# Altium project tronic3_prject.PrjPcb
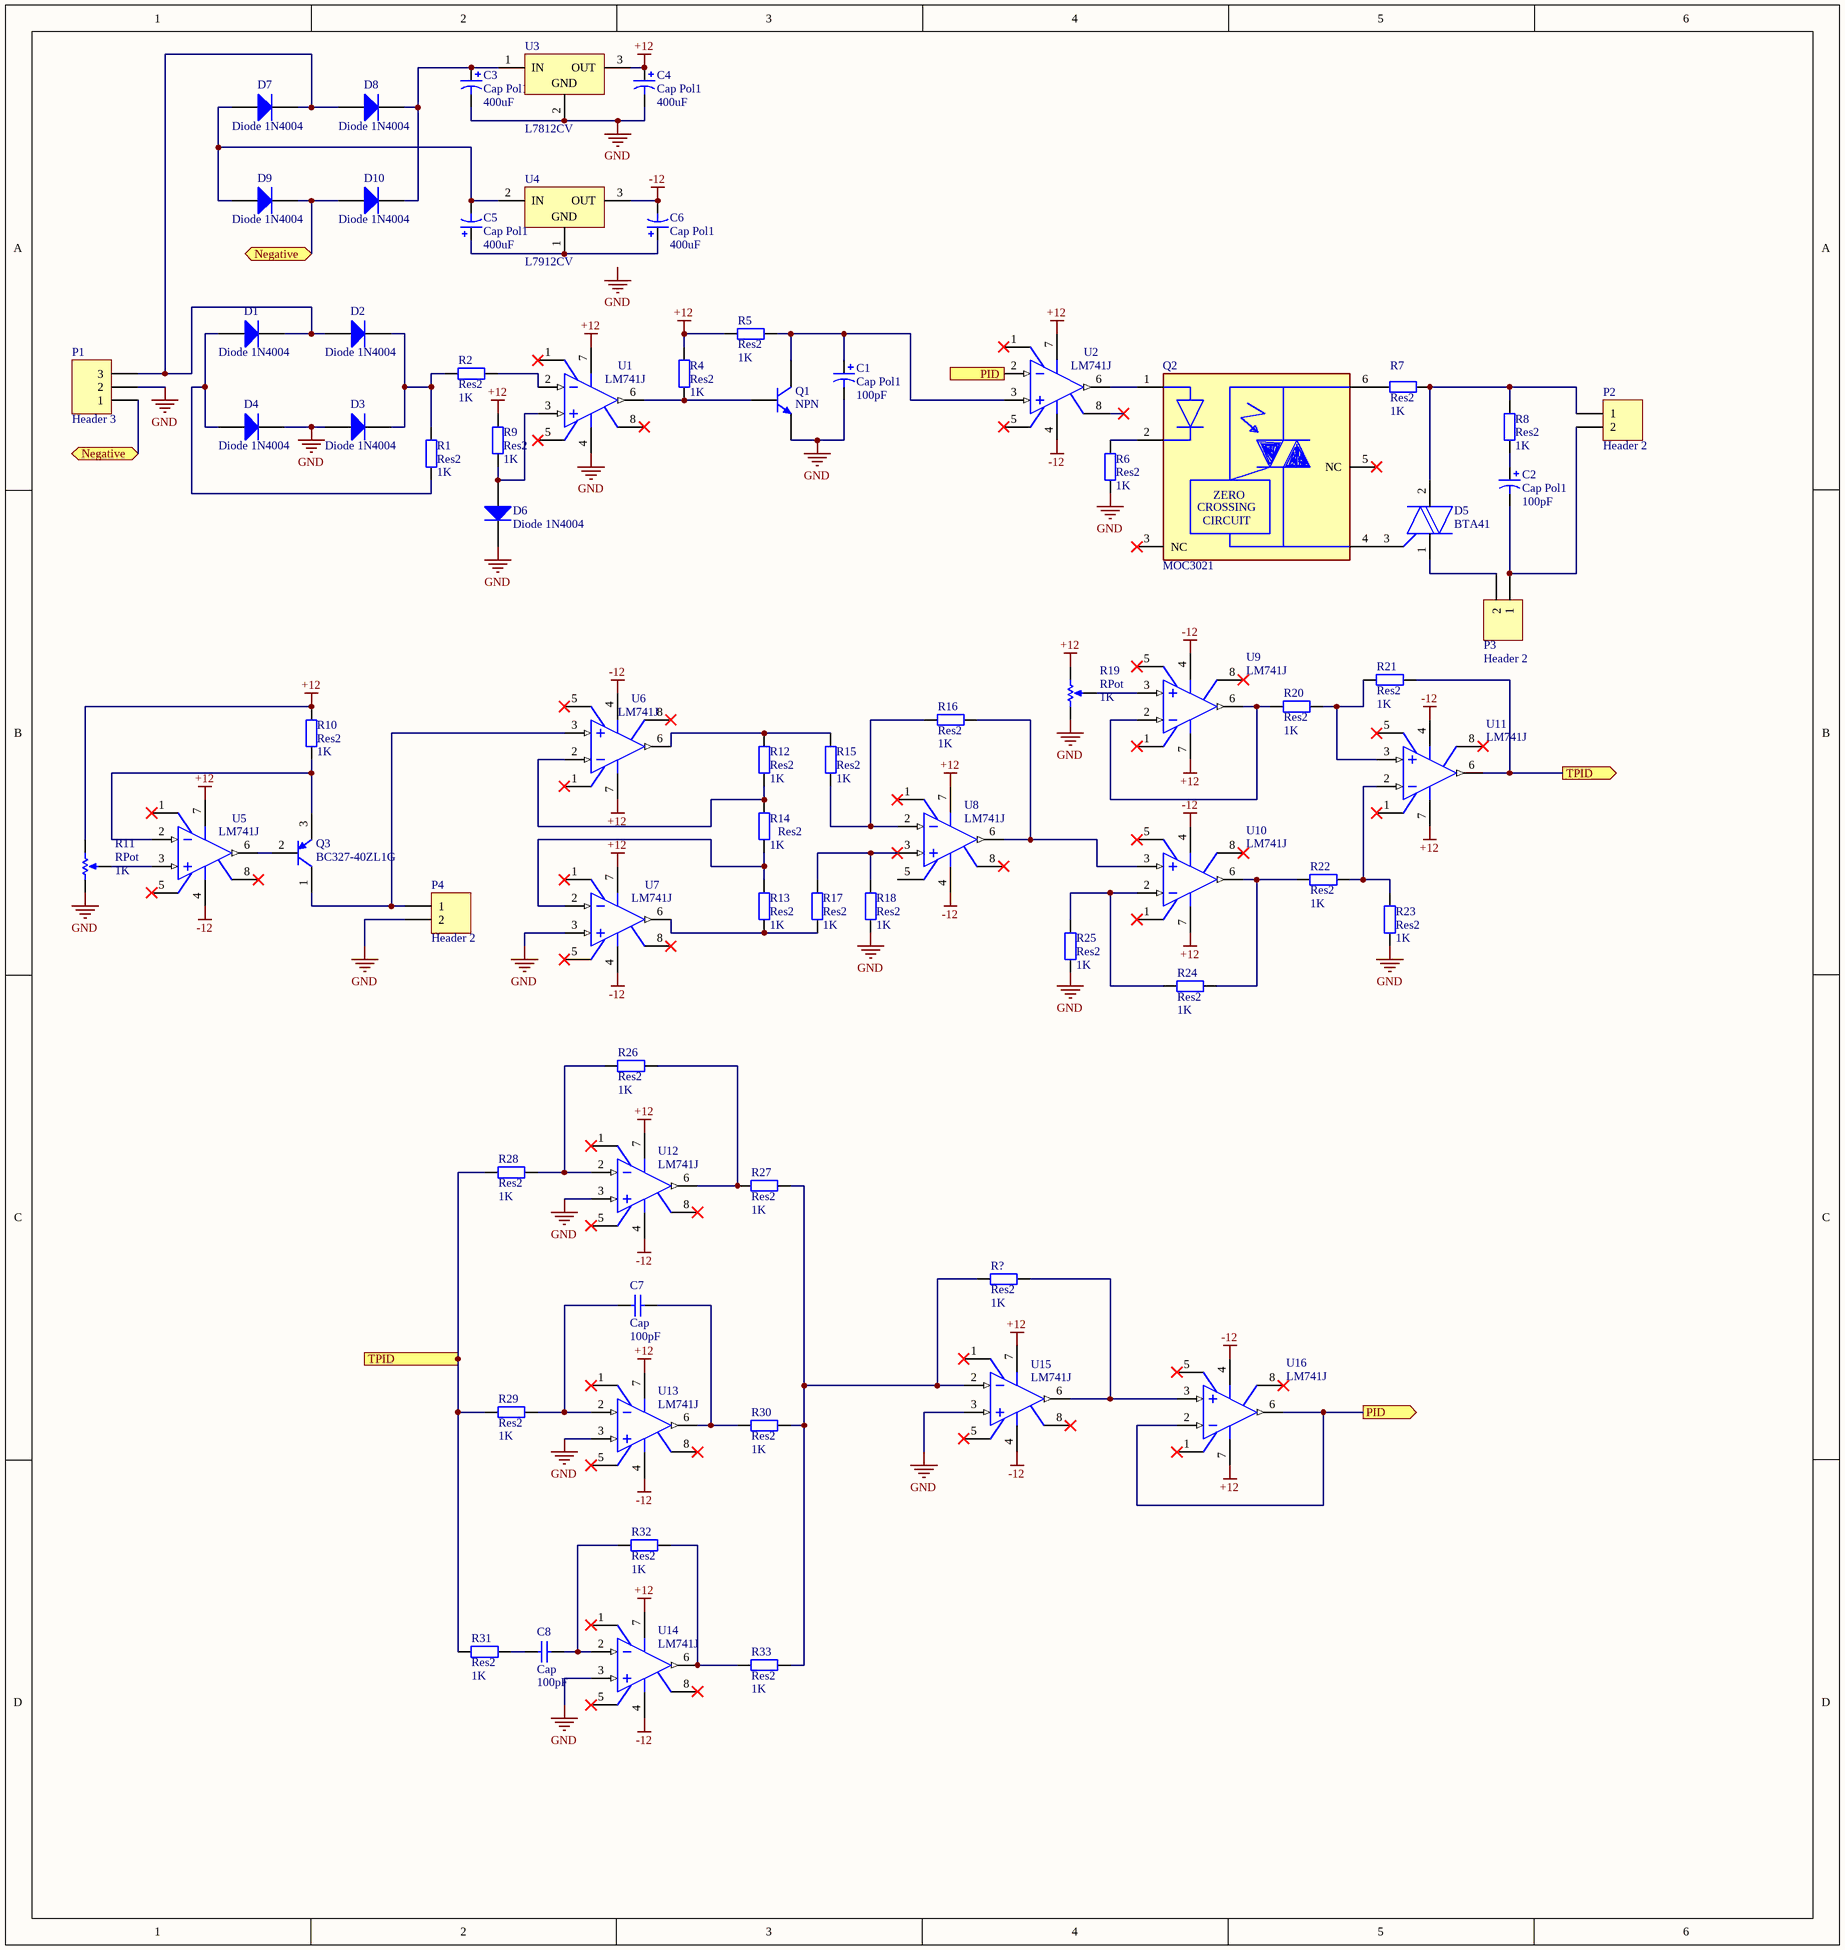
[diagram p0: tronic3_1.SchDoc]
1 sheet, 74 parts. Net scope: flat (ports and power ports of the same name join across sheets).
Board file: PCB1.PcbDoc

## Sheet tronic3_1.SchDoc
size 350 x 369 mm; Date: 9/5/2022; Author: B.D.S. Udayantha; SheetNumber: 1; SheetTotal: 1; SPICEModelCacheOLWESBFQ: <root> / <DocumentId>OLWESBFQ</DocumentId> / <CacheFrame Number="0"> / <Model Name="1n4004" Kind="MDL"> / <Text>*1N4004 MCE 8-16-95 / *400V 1A Si GenPurpose Diode pkg:DIODE0.4 1,2 / .MODEL 1N4004 D(IS=2.55E-9 RS=0.042 N=1.75 TT=5.76E-6 CJO=1.85E-11 / + VJ=0.75 M=0.333 BV=400 IBV=3.95E-5 )</Text> / </Model> / <Model Name="npn" Kind="MDL"> / <Text>*Default NPN BJT / *NPN Trans Pinout: C,B,E / .MODEL NPN NPN()</Text> / </Model> / </CacheFrame> / </root>

### Parts
C1  Cap Pol1  value 100pF  [RB7.6-15]
C2  Cap Pol1  value 100pF  [RB7.6-15]
C3  Cap Pol1  value 400uF  [RB7.6-15]
C4  Cap Pol1  value 400uF  [RB7.6-15]
C5  Cap Pol1  value 400uF  [RB7.6-15]
C6  Cap Pol1  value 400uF  [RB7.6-15]
C7  Cap  value 100pF  [RAD-0.3]
C8  Cap  value 100pF  [RAD-0.3]
D1  Diode 1N4004  [DO-41]
D2  Diode 1N4004  [DO-41]
D3  Diode 1N4004  [DO-41]
D4  Diode 1N4004  [DO-41]
D5  BTA41  [FP-TO-220AB-MFG]
D6  Diode 1N4004  [DO-41]
D7  Diode 1N4004  [DO-41]
D8  Diode 1N4004  [DO-41]
D9  Diode 1N4004  [DO-41]
D10  Diode 1N4004  [DO-41]
P1  Header 3  [HDR1X3]
P2  Header 2  [HDR1X2]
P3  Header 2  [HDR1X2]
P4  Header 2  [HDR1X2]
Q1  NPN  [TO-226-AA]
Q2  MOC3021  [FP-646BX-MFG]
Q3  BC327-40ZL1G  [ONSC-TO-92-3-29-11_AM_BL]
R1  Res2  value 1K  [AXIAL-0.4]
R2  Res2  value 1K  [AXIAL-0.4]
R4  Res2  value 1K  [AXIAL-0.4]
R5  Res2  value 1K  [AXIAL-0.4]
R6  Res2  value 1K  [AXIAL-0.4]
R7  Res2  value 1K  [AXIAL-0.4]
R8  Res2  value 1K  [AXIAL-0.4]
R9  Res2  value 1K  [AXIAL-0.4]
R10  Res2  value 1K  [AXIAL-0.4]
R11  RPot  value 1K  [VR5]
R12  Res2  value 1K  [AXIAL-0.4]
R13  Res2  value 1K  [AXIAL-0.4]
R14  Res2  value 1K  [AXIAL-0.4]
R15  Res2  value 1K  [AXIAL-0.4]
R16  Res2  value 1K  [AXIAL-0.4]
R17  Res2  value 1K  [AXIAL-0.4]
R18  Res2  value 1K  [AXIAL-0.4]
R19  RPot  value 1K  [VR5]
R20  Res2  value 1K  [AXIAL-0.4]
R21  Res2  value 1K  [AXIAL-0.4]
R22  Res2  value 1K  [AXIAL-0.4]
R23  Res2  value 1K  [AXIAL-0.4]
R24  Res2  value 1K  [AXIAL-0.4]
R25  Res2  value 1K  [AXIAL-0.4]
R26  Res2  value 1K  [AXIAL-0.4]
R27  Res2  value 1K  [AXIAL-0.4]
R28  Res2  value 1K  [AXIAL-0.4]
R29  Res2  value 1K  [AXIAL-0.4]
R30  Res2  value 1K  [AXIAL-0.4]
R31  Res2  value 1K  [AXIAL-0.4]
R32  Res2  value 1K  [AXIAL-0.4]
R33  Res2  value 1K  [AXIAL-0.4]
R?  Res2  value 1K  [AXIAL-0.4]
U1  LM741J  [NAB0008A]
U2  LM741J  [NAB0008A]
U3  L7812CV  [TO220]
U4  L7912CV  [TO-220]
U5  LM741J  [NAB0008A]
U6  LM741J  [NAB0008A]
U7  LM741J  [NAB0008A]
U8  LM741J  [NAB0008A]
U9  LM741J  [NAB0008A]
U10  LM741J  [NAB0008A]
U11  LM741J  [NAB0008A]
U12  LM741J  [NAB0008A]
U13  LM741J  [NAB0008A]
U14  LM741J  [NAB0008A]
U15  LM741J  [NAB0008A]
U16  LM741J  [NAB0008A]

### Ports
Negative (bidir), PID (in), PID (out), TPID (in), TPID (out)

### Nets
+12: C4.1 R4.1 R5.1 R9.1 R10.1 R11.2(BOT) R19.2(BOT) U1.7(V+) U2.7(V+) U3.3(OUT) U5.7(V+) U6.7(V+) U7.7(V+) U8.7(V+) U9.7(V+) U10.7(V+) U11.7(V+) U12.7(V+) U13.7(V+) U14.7(V+) U15.7(V+) U16.7(V+)
-12: C6.2 U2.4(V-) U4.3(OUT) U5.4(V-) U6.4(V-) U7.4(V-) U8.4(V-) U9.4(V-) U10.4(V-) U11.4(V-) U12.4(V-) U13.4(V-) U14.4(V-) U15.4(V-) U16.4(V-)
GND: C1.2 C3.2 C4.2 D3.1(A) D4.2(K) D6.2(K) P1.2 P4.2 Q1.3(E) R6.2 R11.1(TOP) R18.2 R19.1(TOP) R23.2 R25.1 U1.4(V-) U3.2(GND) U7.3(IN+) U12.3(IN+) U13.3(IN+) U14.3(IN+) U15.3(IN+)
NetC1_1: C1.1 Q1.1(C) R5.2 U2.3(IN+)
NetC2_1: C2.1 R8.2
NetC2_2: C2.2 P2.2 P3.1
NetC3_1: C3.1 D8.2(K) D10.2(K) U3.1(IN)
NetC5_1: C5.1 C6.1 U4.1(GND)
NetC5_2: C5.2 D7.1(A) D9.1(A) U4.2(IN)
NetC7_1: C7.1 R29.2 U13.2(IN-)
NetC7_2: C7.2 R30.1 U13.6(OUT)
NetC8_1: C8.1 R31.2
NetC8_2: C8.2 R32.1 U14.2(IN-)
NetD1_1: D1.1(A) D4.1(A) R1.2
NetD1_2: D1.2(K) D2.1(A) D7.2(K) D8.1(A) P1.3
NetD2_2: D2.2(K) D3.2(K) R1.1 R2.1
NetD5_1: D5.1(A1) P3.2
NetD5_2: D5.2(A2) P2.1 R7.2 R8.1
NetD5_3: D5.3(G) Q2.4(1_MAIN_TERM.)
NetD6_1: D6.1(A) R9.2 U1.3(IN+)
NetD9_2: D9.2(K) D10.1(A) P1.1 ; port Negative
NetP4_1: P4.1 Q3.1(C) U6.3(IN+)
NetQ1_2: Q1.2(B) R4.2 U1.6(OUT)
NetQ2_1: Q2.1(A) U2.6(OUT)
NetQ2_2: Q2.2(C) R6.1
NetQ2_6: Q2.6(2_MAIN_TERM.) R7.1
NetQ3_2: Q3.2(B) U5.6(OUT)
NetQ3_3: Q3.3(E) R10.2 U5.2(IN-)
NetR2_2: R2.2 U1.2(IN-)
NetR11_3: R11.3(TAP) U5.3(IN+)
NetR12_1: R12.1 R15.1 U6.6(OUT)
NetR12_2: R12.2 R14.1 U6.2(IN-)
NetR13_1: R13.1 R14.2 U7.2(IN-)
NetR13_2: R13.2 R17.2 U7.6(OUT)
NetR15_2: R15.2 R16.1 U8.2(IN-)
NetR16_2: R16.2 U8.6(OUT) U10.3(IN+)
NetR17_1: R17.1 R18.1 U8.3(IN+)
NetR19_3: R19.3(TAP) U9.3(IN+)
NetR20_1: R20.1 U9.2(IN-) U9.6(OUT)
NetR20_2: R20.2 R21.1 U11.3(IN+)
NetR21_2: R21.2 R28.1 R29.1 R31.1 U11.6(OUT) ; port TPID
NetR22_1: R22.1 R24.2 U10.6(OUT)
NetR22_2: R22.2 R23.1 U11.2(IN-)
NetR24_1: R24.1 R25.2 U10.2(IN-)
NetR26_1: R26.1 R28.2 U12.2(IN-)
NetR26_2: R26.2 R27.1 U12.6(OUT)
NetR27_2: R27.2 R30.2 R33.2 R?.1 U15.2(IN-)
NetR32_2: R32.2 R33.1 U14.6(OUT)
NetR?_2: R?.2 U15.6(OUT) U16.3(IN+)
NetU2_2: U2.2(IN-) U16.2(IN-) U16.6(OUT) ; port PID

Not connected (* = marked no-connect by the designer): Q2 3(NC)* 5(NC)*; U1 1(OFS_NULL)* 5(OFS_NULL)* 8(NC)*; U2 1(OFS_NULL)* 5(OFS_NULL)* 8(NC)*; U5 1(OFS_NULL)* 5(OFS_NULL)* 8(NC)*; U6 1(OFS_NULL)* 5(OFS_NULL)* 8(NC)*; U7 1(OFS_NULL)* 5(OFS_NULL)* 8(NC)*; U8 1(OFS_NULL)* 5(OFS_NULL) 8(NC)*; U9 1(OFS_NULL)* 5(OFS_NULL)* 8(NC)*; U10 1(OFS_NULL)* 5(OFS_NULL)* 8(NC)*; U11 1(OFS_NULL)* 5(OFS_NULL)* 8(NC)*; U12 1(OFS_NULL)* 5(OFS_NULL)* 8(NC)*; U13 1(OFS_NULL)* 5(OFS_NULL)* 8(NC)*; U14 1(OFS_NULL)* 5(OFS_NULL)* 8(NC)*; U15 1(OFS_NULL)* 5(OFS_NULL)* 8(NC)*; U16 1(OFS_NULL)* 5(OFS_NULL)* 8(NC)*

### Notes on the sheet
- Labels drawn without touching a wire or pin: GND
- (in symbol CMP-07144-000005-1) ZERO; CROSSING; CIRCUIT

### Library data of the parts
C1-C6 = Cap Pol1: Polarized Capacitor (Radial); Published: 8-Jun-2000; LatestRevisionDate: 17-Jul-2002; LatestRevisionNote: Re-released for DXP Platform.; PackageReference: RB7.6-15; Publisher: Altium Limited; PackageDescription: Polarized Capacitor (Radial); 2 Leads
C7 C8 = Cap: Capacitor; Published: 8-Jun-2000; LatestRevisionDate: 17-Jul-2002; LatestRevisionNote: Re-released for DXP Platform.; PackageReference: RAD-0.3; Publisher: Altium Limited; PackageDescription: Radial Cap, Thru-Hole; 2 Leads; 0.3 in Pin Spacing
D1-D4 D6-D10 = Diode 1N4004: 1 Amp General Purpose Rectifier; Published: 8-Jun-2000; LatestRevisionDate: 17-Jul-2002; LatestRevisionNote: Re-released for DXP Platform.; DatasheetVersion: 1998; PackageVersion: Aug-1999; PackageReference: DO-41; Publisher: Altium Limited; PackageDescription: Diode, Axial; Body 5.2 x 2.7 mm (LxDia. max), Lead Dia. 0.86 mm (max); Code_JEDEC: DO-204-AL; ComponentLink1Description: Manufacturer Link; ComponentLink1URL: http://www.fairchildsemi.com/; ComponentLink2Description: Datasheet; ComponentLink2URL: http://www.fairchildsemi.com/ds/1N%2F1N4001.pdf
D5 = CMP-12193-000008-1: TRIAC ALTERNISTOR 600V TO220AB; Manufacturer: STMicroelectronics; Manufacturer Part Number: BTA24-600BWRG; On State Current Rms: 25A; Max Junction Temp: +125°C; Hold Current: 75mA; Gate Trigger Voltage: 1.3V; Gate Trigger Current: 50mA; Standoff Height: 3.75mm; Forward Voltage: 1.55V; Off State Voltage: 600V; Category: Diode; Temperature Range Low: -40°C; ComponentLink2URL: https://www.st.com/resource/en/datasheet/bta24.pdf; Temperature: -40°C to +125°C; ComponentLink2Description: Datasheet; Automotive: No; Lead Free: Yes; Mouser Description: Triacs 25 Amp 600 Volt; Temperature Range High: +125°C; Digikey Description: TRIAC ALTERNISTOR 600V TO220AB; Octopart: https://octopart.com/bta24-600bwrg-stmicroelectronics-360258; RoHS: TRUE; Device Class L2: Thyristors; Height: 19.65mm; Device Class L1: Discrete Semiconductors; Device Class L3: TRIACs; Package: TO-220AB
P1 = Header 3: Header, 3-Pin; LatestRevisionDate: 17-Jul-2002; LatestRevisionNote: Re-released for DXP Platform.; Publisher: Altium Limited
P2-P4 = Header 2: Header, 2-Pin; LatestRevisionDate: 17-Jul-2002; LatestRevisionNote: Re-released for DXP Platform.; Publisher: Altium Limited
Q1 = NPN: NPN Bipolar Transistor; Published: 8-Jun-2000; LatestRevisionDate: 17-Jul-2002; LatestRevisionNote: Re-released for DXP Platform.; PackageReference: TO-226-AA; Publisher: Altium Limited; PackageDescription: TO, Flat Index; 3 In-Line, Axial Leads; Body Dia. 4.8mm; Leads 0.55 x 0.51 mm (max); Code_JEDEC: TO-226-AA
Q2 = CMP-07144-000005-1: OPTOISOLATOR 4.17KV TRIAC 6DIP; Manufacturer Part Number: MOC3041M; Manufacturer: ON Semiconductor; Forward Voltage: 1.25V; Power Dissipation: 250mW; Forward Current: 30mA; Reverse Voltage: 6V; Max Junction Temp: +100°C; Isolation Voltage: 4170Vrms; Standoff Height: 0.38mm; Octopart: https://octopart.com/moc3041m-on+semiconductor-84330395; Temperature Range Low: -40°C; Category: Trans; Package: 646BX; Height: 5.08mm; ComponentLink2Description: Datasheet; Device Class L2: Optocouplers; Device Class L1: Optoelectronics; Device Class L3: unset; Automotive: No; RoHS: TRUE; Mouser Description: Optocoupler Triac AC Output 1 Channel 400VDRM 6-Pin Plastic Dip White Bulk; Temperature: -40°C to +85°C; Lead Free: Yes; ComponentLink2URL: https://www.onsemi.com/pub/Collateral/MOC3043M-D.pdf; Digikey Description: OPTOISOLATOR 4.17KV TRIAC 6DIP; Temperature Range High: +85°C; Footprint Url: https://www.onsemi.com/pub/Collateral/646BX.PDF
Q3 = CMP-1048-01589-1: Amplifier Transistor, PNP Silicon, 3-Pin TO-92, Pb-Free, Ammo Box; Manufacturer: On Semiconductor; IC Continuous (A): -0.8; ComponentLink2Description: Datasheet; ComponentLink1URL: http://www.onsemi.com/; Packing: Ammo Box; ComponentLink3Description: Package Specification; DatasheetVersion: Rev. 6; PartNumber: BC327-40ZL1G; PackageDescription: 3-Pin Transistor Outline, Body 4.825 x 3.685 mm, Pitch 1.27 mm; RoHS: TRUE; PackageReference: TO-92-3-29-11_AM_BL; Mounting Technology: Through Hole; ComponentLink1Description: Manufacturer URL; ComponentLink3URL: http://www.onsemi.com/pub_link/Collateral/MAC97-D.PDF; Polarity: PNP; PackageVersion: Rev. AM; ComponentLink2URL: http://www.onsemi.com/pub_link/Collateral/BC327-D.PDF
R1 R2 R4-R10 R12-R18 R20-R33 R? = Res2: Resistor; Published: 8-Jun-2000; LatestRevisionDate: 17-Jul-2002; LatestRevisionNote: Re-released for DXP Platform.; PackageReference: AXIAL-0.4; Publisher: Altium Limited; PackageDescription: Axial Device, Thru-Hole; 2 Leads; 0.4 in Pin Spacing
R11 R19 = RPot: Potentiometer; Sim Note: Enter the Resistance value and the set point into parameter fields.; Set Position: 0.5; Published: 8-Jun-2000; LatestRevisionDate: 17-Jul-2002; LatestRevisionNote: Re-released for DXP Platform.; PackageReference: VR5; Publisher: Altium Limited; PackageDescription: Variable Resistor, Thru-Hole; 3 Leads
U1 U2 U5-U16 = CMP-0055-00160-3: Operational Amplifier, 8-pin CerDIP; Manufacturer: Texas Instruments; PackageTopMarking: NSUZXYTT*LM741J; CompType: Amplifiers; PowerWise: N; PackageDescription: Cerdip, .400 x .310in Body, 8 Lead, .300in Centers, .100in Pitch; PinCount: 8; RoHS: N; Package Reference: NAB0008A; ComponentLink1Description: Datasheet URL; ComponentLink1URL: http://www.ti.com/general/docs/lit/getliterature.tsp?genericPartNumber=LM741&fileType=pdf
U3 = CMP-0244-00450-1: Positive Voltage Regulator, 12V, 3-Pin TO-220; PackageDescription: TO, Thru-Hole, Vertical, Heatsink Mounted; 3 In-Line Leads; Pitch 2.54 mm; ComponentLink3URL: http://www.st.com/internet/com/TECHNICAL_RESOURCES/TECHNICAL_LITERATURE/PACKAGE_INFORMATION/CD00004649.pdf; ComponentLink1URL: http://www.st.com; ComponentLink2Description: Datasheet; ComponentLink3Description: Package Specification; ComponentLink2URL: http://www.st.com/internet/com/TECHNICAL_RESOURCES/TECHNICAL_LITERATURE/DATASHEET/CD00000444.pdf; DatasheetVersion: 16/11/2011; PackageVersion: ver3.0; PackageReference: TO220; ComponentLink1Description: Manufacturer URL
U4 = CMP-0244-00457-1: Negative Voltage Regulator, -12V, 3-Pin TO-220; PackageReference: TO-220; PackageVersion: 2011; PackageDescription: TO, Thru-Hole, Vertical, Heatsink Mounted; 3 In-Line Leads; Pitch 2.54 mm; ComponentLink1Description: Manufacturer URL; ComponentLink2URL: http://www.st.com/internet/com/TECHNICAL_RESOURCES/TECHNICAL_LITERATURE/DATASHEET/CD00000450.pdf; ComponentLink2Description: Datasheet; ComponentLink1URL: http://www.st.com; DatasheetVersion: 1/11/2011